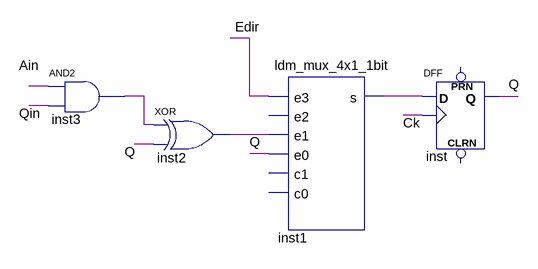
[diagram p0: schematic sheet]
// Quartus schematic ldm_ffd_ce.bdf as structural Verilog: 4 symbols, 0 pins
module ldm_ffd_ce (
);

  wire Ain, Ck, Edir, inst1_s, inst2_out, inst3_out, Q, Qin;

  and inst3 (inst3_out, Ain, Qin);
  xor inst2 (inst2_out, inst3_out, Q);
  ldm_mux_4x1_1bit inst1 (.e3(Edir), .e1(inst2_out), .e0(Q), .s(inst1_s));  // open: e2, c1, c0
  DFF inst (.CLK(Ck), .D(inst1_s), .Q(Q));  // open: CLRN, PRN
endmodule
